# EAGLE schematic schematic (EAGLE 9.1.1)
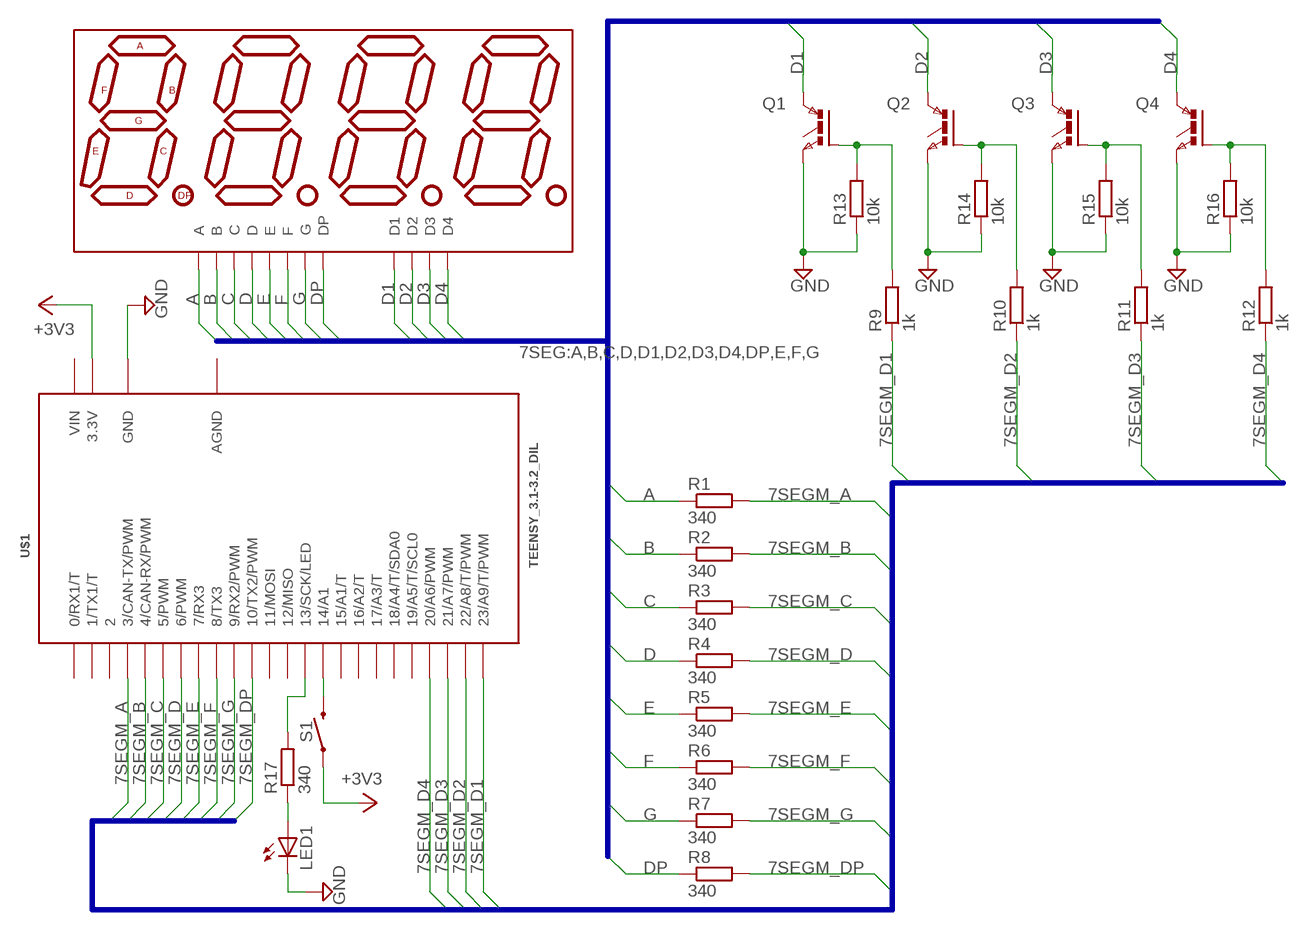
[diagram p0: schematic, sheet 1]

## Parts
DISP1  7-SEGMENT-4DIGIT-COUNTER-HP-BUBBLE  [DIL12]
LED1  LED_ELD260  [LED_LD260]
Q1  IGBTTO251AA  [TO251AA]
Q2  IGBTTO251AA  [TO251AA]
Q3  IGBTTO251AA  [TO251AA]
Q4  IGBTTO251AA  [TO251AA]
R1  340  R-EU_0204/5  [0204/5]
R2  340  R-EU_0204/5  [0204/5]
R3  340  R-EU_0204/5  [0204/5]
R4  340  R-EU_0204/5  [0204/5]
R5  340  R-EU_0204/5  [0204/5]
R6  340  R-EU_0204/5  [0204/5]
R7  340  R-EU_0204/5  [0204/5]
R8  340  R-EU_0204/5  [0204/5]
R9  1k  R-EU_0204/5  [0204/5]
R10  1k  R-EU_0204/5  [0204/5]
R11  1k  R-EU_0204/5  [0204/5]
R12  1k  R-EU_0204/5  [0204/5]
R13  10k  R-EU_0204/5  [0204/5]
R14  10k  R-EU_0204/5  [0204/5]
R15  10k  R-EU_0204/5  [0204/5]
R16  10k  R-EU_0204/5  [0204/5]
R17  340  R-EU_0204/5  [0204/5]
S1  MOMENTARY-SWITCH-SPST-PTH-6.0MM  [TACTILE_SWITCH_PTH_6.0MM]
U$1  TEENSY_3.1-3.2_DIL  [TEENSY_3.0-3.2&LC_DIL]

## Nets
7SEGM_A: R1.2 U$1.3(3/CAN-TX/PWM)
7SEGM_B: R2.2 U$1.4(4/CAN-RX/PWM)
7SEGM_C: R3.2 U$1.5(5/PWM)
7SEGM_D: R4.2 U$1.6(6/PWM)
7SEGM_D1: R9.1 U$1.23/A9(23/A9/T/PWM)
7SEGM_D2: R10.1 U$1.22/A8(22/A8/T/PWM)
7SEGM_D3: R11.1 U$1.21/A7(21/A7/PWM)
7SEGM_D4: R12.1 U$1.20/A6(20/A6/PWM)
7SEGM_DP: R8.2 U$1.10(10/TX2/PWM)
7SEGM_E: R5.2 U$1.7(7/RX3)
7SEGM_F: R6.2 U$1.8(8/TX3)
7SEGM_G: R7.2 U$1.9(9/RX2/PWM)
+3V3: S1.1 U$1.3.3V
A: DISP1.12(A) R1.1
B: DISP1.11(B) R2.1
C: DISP1.3(C) R3.1
D: DISP1.8(D) R4.1
D1: DISP1.1(D1) Q1.2(C)
D2: DISP1.10(D2) Q2.2(C)
D3: DISP1.4(D3) Q3.2(C)
D4: DISP1.6(D4) Q4.2(C)
DP: DISP1.5(DP) R8.1
E: DISP1.2(E) R5.1
F: DISP1.9(F) R6.1
G: DISP1.7(G) R7.1
GND: LED1.K(C) Q1.3(E) Q2.3(E) Q3.3(E) Q4.3(E) R13.1 R14.1 R15.1 R16.1 U$1.GND
N$2: Q1.1(G) R9.2 R13.2
N$3: S1.3 U$1.14/A0(14/A1)
N$4: R17.2 U$1.13(13/SCK/LED)
N$5: Q2.1(G) R10.2 R14.2
N$6: LED1.A R17.1
N$8: Q3.1(G) R11.2 R15.2
N$11: Q4.1(G) R12.2 R16.2
Unconnected: U$1.0(0/RX1/T) U$1.1(1/TX1/T) U$1.2 U$1.11(11/MOSI) U$1.12(12/MISO) U$1.15/A1(15/A1/T) U$1.16/A2(16/A2/T) U$1.17/A3(17/A3/T) U$1.18/A4(18/A4/T/SDA0) U$1.19/A5(19/A5/T/SCL0)

## Buses
7SEG:A,B,C,D,D1,D2,D3,D4,DP,E,F,G
7SEGM:7SEGM_A,7SEGM_B,7SEGM_C,7SEGM_D,7SEGM_D1,7SEGM_D2,7SEGM_D3,7SEGM_D4,7SEGM_DP,7SEGM_E,7SEGM_F,7SEGM_G

## Power pins joined to a net without a drawn wire
AGND: U$1.AGND
VIN: U$1.VIN

## Library data of the parts
DISP1 = SparkFun-Displays:7-SEGMENT-4DIGIT-COUNTER; STOREFRONT: COM-12710
LED1 = eagle-ltspice:LED_E: LED Source: http://www.osram.convergy.de Source: www.luxeon.com Source: www.kingbright.com; SPICEMODEL: NONE; SPICEPREFIX: D; SPICETYPE: diode
Q1-Q4 = IGBT:IGBT: IGBT
R1-R17 = resistor:R-EU_: RESISTOR, European symbol
S1 = SparkFun-Switches:MOMENTARY-SWITCH-SPST: Momentary Switch (Pushbutton) - SPST Normally-open (NO) SPST momentary switches (buttons, pushbuttons). Variants PTH-12MM - 12mm square, through-hole Momentary Pushbutton Switch - 12mm Square <https://www.sparkfun.com/products/9190> (COM-09190) PTH-6.0MM, PTH-6.0MM-KIT - 6.0mm square, through-hole Mini Pushbutton Switch <https://www.sparkfun.com/products/97> (COM-00097) KIT package intended for soldering kit's - only one side of pads' copper is exposed. PTH-RIGHT-ANGLE-KIT - Right-angle, through-hole Right Angle Tactile Button <https://www.sparkfun.com/products/10791> - Used on SparkFun BigTime Watch Kit <https://www.sparkfun.com/products/11734> SMD-12MM - 12mm square, surface-mount Tactile Button - SMD (12mm) <https://www.sparkfun.com/products/12993> (COM-12993) Used on SparkFun PicoBoard <https://www.sparkfun.com/products/11888> SMD-4.5MM - 4.5mm Square Trackball Switch Used on SparkFun Blackberry Trackballer Breakout <https://www.sparkfun.com/products/13169> SMD-4.6MMX2.8MM - 4.60mm x 2.80mm, surface mount Used on SparkFun SAMD21 Mini Breakout <https://www.sparkfun.com/products/13664> SMD-5.2MM, SMD-5.2-REDUNDANT - 5.2mm square, surface-mount Mini Pushbutton Switch - SMD <https://www.sparkfun.com/products/8720> (COM-08720) Used on Arduino Pro Mini <https://www.sparkfun.com/products/11114> REDUNDANT package connects both switch circuits together SMD-6.0X3.5MM - 6.0 x 3.5mm, surface mount Momentary Reset Switch SMD <https://www.sparkfun.com/products/8229> (COM-08229) SMD-6.2MM-TALL - 6.2mm square, surface mount Tactile Button - SMD (6mm) <https://www.sparkfun.com/products/12992> Used on SparkFun Digital Sandbox <https://www.sparkfun.com/products/12651> SMD-RIGHT-ANGLE - Right-angle, surface mount Used on SparkFun Block for Intel® Edison - Arduino <https://www.sparkfun.com/products/13036>; PROD_ID: SWCH-08441; SF_SKU: COM-00097
U$1 = Teensy_3_and_LC_Series_Boards_v1.4:TEENSY_3.1-3.2_DIL: Teensy 3.1 or 3.2 in a DIL Layout.